# Altium schematic sheet Interface Connector.SchDoc
size A4; Author: Thomas Kreppel; CompanyName: Universidad de Santiago de Chile; Address1: Avenida Ecuador Nº 3519; Address2: Estación Central, Santiago; Address3: Chile; DocumentNumber: 2; SheetNumber: 2; SheetTotal: 10
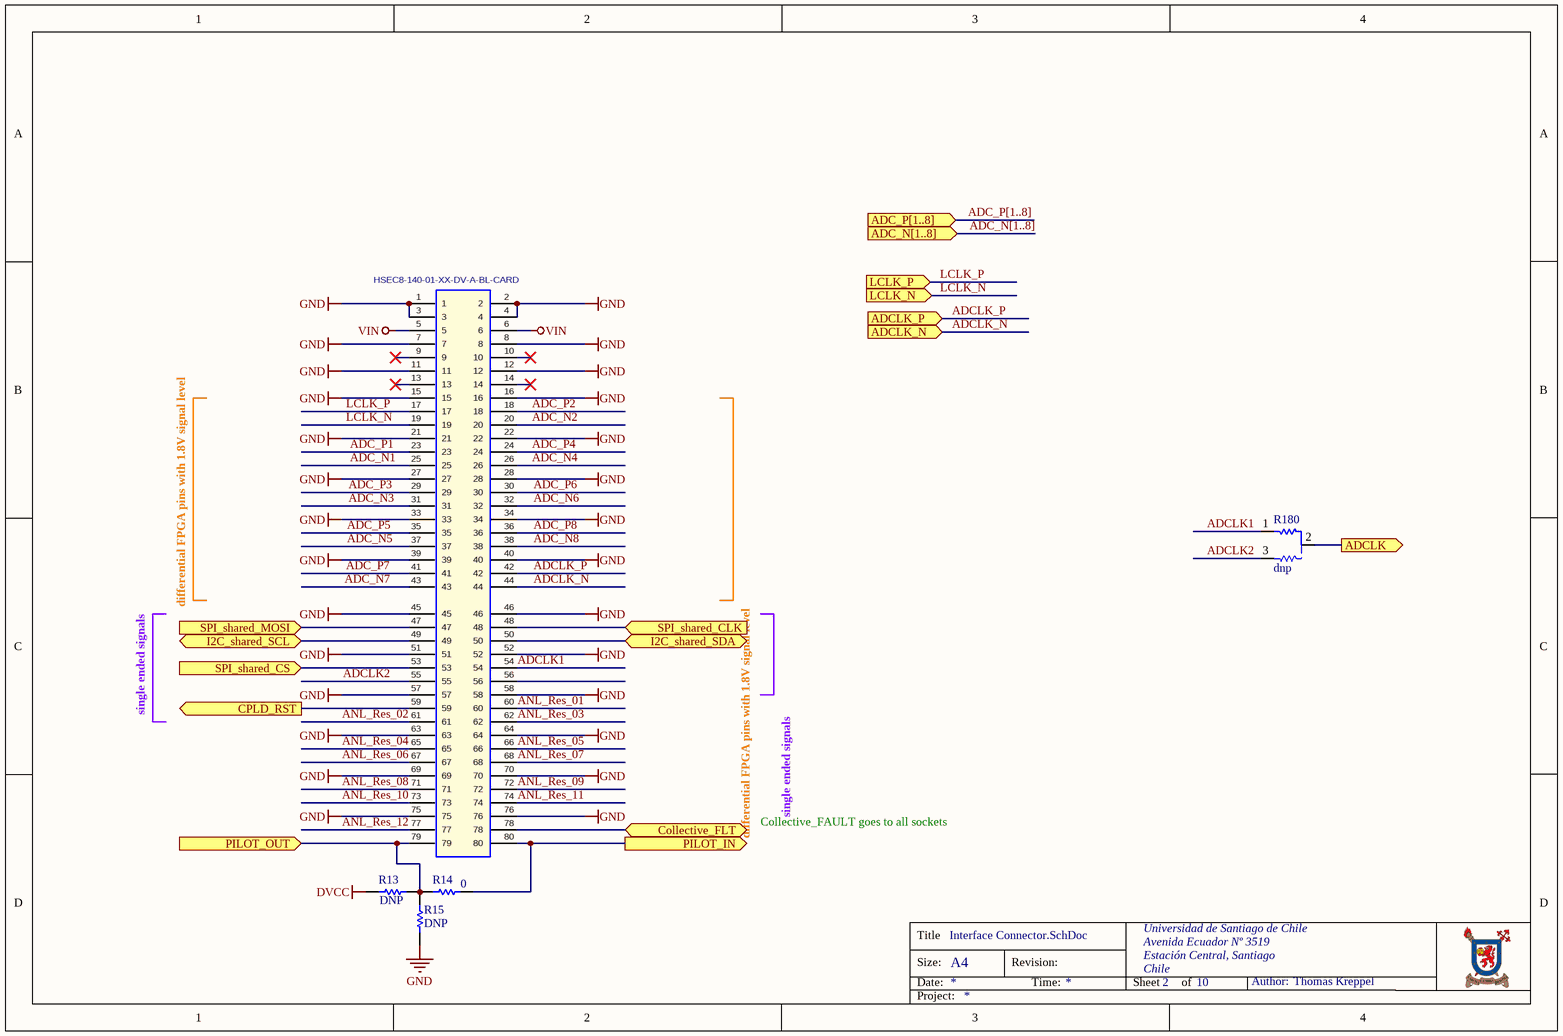
[diagram p0: Interface Connector.SchDoc]

## Parts
R13  DNP  [RES_0603]  (no BOM)
R14  0  [RES_0603]
R15  DNP  [RES_0603]  (no BOM)
R180  dnp  [0603_Config]  (no BOM)
X2  HSEC8-140-01-XX-DV-A-BL-CARD  [HSEC8-140-01-XX-DV-A-BL-CARD]  (no BOM)

## Ports
ADC_N[1..8] (in), ADC_P[1..8] (in), ADCLK (out), ADCLK_N (in), ADCLK_P (in), Collective_FLT (bidir), CPLD_RST (out), I2C_shared_SCL (bidir), I2C_shared_SDA (bidir), LCLK_N (in), LCLK_P (in), PILOT_IN (out), PILOT_OUT (in), SPI_shared_CLK (in), SPI_shared_CS (in), SPI_shared_MOSI (in)

## Nets
DVCC: R13.2
GND: R15.2 X2.1 X2.2 X2.3 X2.4 X2.7 X2.8 X2.11 X2.12 X2.15 X2.16 X2.21 X2.22 X2.27 X2.28 X2.33 X2.34 X2.39 X2.40 X2.45 X2.46 X2.51 X2.52 X2.57 X2.58 X2.63 X2.64 X2.69 X2.70 X2.75 X2.76
VIN: X2.5 X2.6
ADC_N1: X2.25
ADC_N2: X2.20
ADC_N3: X2.31
ADC_N4: X2.26
ADC_N5: X2.37
ADC_N6: X2.32
ADC_N7: X2.43
ADC_N8: X2.38
ADC_P1: X2.23
ADC_P2: X2.18
ADC_P3: X2.29
ADC_P4: X2.24
ADC_P5: X2.35
ADC_P6: X2.30
ADC_P7: X2.41
ADC_P8: X2.36
ADCLK: R180.2 ; port ADCLK
ADCLK1: R180.1 X2.54
ADCLK2: R180.3 X2.55
ADCLK_N: X2.44 ; port ADCLK_N
ADCLK_P: X2.42 ; port ADCLK_P
ANL_Res_01: X2.60
ANL_Res_02: X2.61
ANL_Res_03: X2.62
ANL_Res_04: X2.65
ANL_Res_05: X2.66
ANL_Res_06: X2.67
ANL_Res_07: X2.68
ANL_Res_08: X2.71
ANL_Res_09: X2.72
ANL_Res_10: X2.73
ANL_Res_11: X2.74
ANL_Res_12: X2.77
Collective_FLT: X2.78 ; port Collective_FLT
CPLD_RST: X2.59 ; port CPLD_RST
I2C_shared_SCL: X2.49 ; port I2C_shared_SCL
I2C_shared_SDA: X2.50 ; port I2C_shared_SDA
LCLK_N: X2.19 ; port LCLK_N
LCLK_P: X2.17 ; port LCLK_P
PILOT_IN: R14.1 X2.80 ; port PILOT_IN
PILOT_OUT: R13.1 R14.2 R15.1 X2.79 ; port PILOT_OUT
SPI_shared_CLK: X2.48 ; port SPI_shared_CLK
SPI_shared_CS: X2.53 ; port SPI_shared_CS
SPI_shared_MOSI: X2.47 ; port SPI_shared_MOSI

Not connected (* = marked no-connect by the designer): X2 9* 10* 13* 14* 56

## Buses and harness runs
bus ADC_N[1..8] = port ADC_N[1..8]
bus ADC_P[1..8] = port ADC_P[1..8]

## Notes on the sheet
- differential FPGA pins with 1.8V signal level
- single ended signals
- Collective_FAULT goes to all sockets
- Title
- Size:
- Date:
- A4
- Revision:
- Time:
- Sheet
- of
- Author:
- Project:

## Library data of the parts
R13 R15 = Res0603: Manufacturer Part-Number: RC0603JR-070RL; Value: 0; Tolerance: 1%; Published: 8-Jun-2000; LatestRevisionDate: 17-Jul-2002; LatestRevisionNote: Re-released for DXP Platform.; PackageReference: AXIAL-0.3; Publisher: Altium Limited; PackageDescription: Axial Device, Thru-Hole; 2 Leads; 0.3 in Pin Spacing; Supplier 1: Digikey; Supplier 2: Mouser; Supplier Part Number 1: 311-0.0GRCT-ND; Package: 0603
R14 = Res0603: Manufacturer Part-Number: RC0603JR-070RL; Tolerance: 1%; Published: 8-Jun-2000; LatestRevisionDate: 17-Jul-2002; LatestRevisionNote: Re-released for DXP Platform.; PackageReference: AXIAL-0.3; Publisher: Altium Limited; PackageDescription: Axial Device, Thru-Hole; 2 Leads; 0.3 in Pin Spacing; Value: 0; Supplier 1: Digikey; Supplier 2: Mouser; Supplier Part Number 1: 311-0.0GRCT-ND; Package: 0603
R180 = R_config: Solder 0603 resistor/jumper between pads 1 and 2 for standard function. Solter resistor between pads 2 and 3 for alternative function; MPN: MCWR06X1002FTL; Value: 10k; MF: Multicomp; Voltage: 50V; Power: 100mW; Tolerance: 1%; Created: 2018_09_04_AGeiger; Package: 0603; Supplier Part Number 1: 2447230; Supplier 1: Farnell
X2 = HSEC8-140-01-XX-DV-A-BL-CARD: Mating Card Layout for HSEC8-140-01-XX-DV-A-BL; Manufacturer: SAMTEC; Created: 2018_04_23_AGeiger; Value: HSEC8-140-01-XX-DV-A-BL-CARD; Supplier 2: Mouser